# EAGLE design MiniPS-1c (EAGLE 5.06)
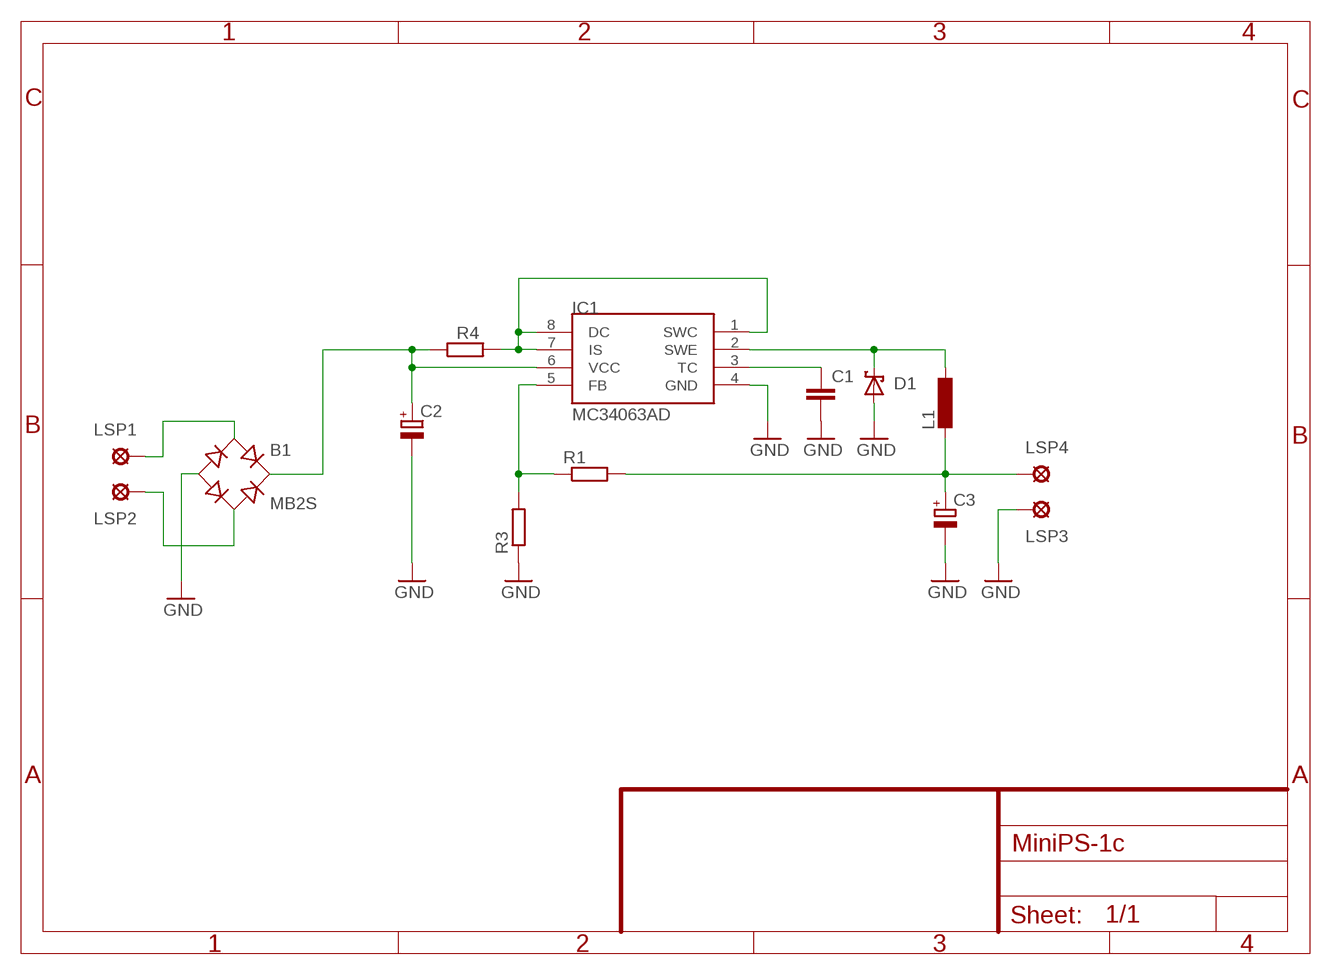
[diagram p0: schematic, sheet 1]

## Parts
B1  MB2S  [SOIC-4]
C1  C-EUC0805  [C0805]
C2  CPOL-EUG  [PANASONIC_G]
C3  CPOL-EUF  [PANASONIC_F]
D1  SCHOTTKY-DIODESMD  [SMB]
IC1  MC34063AD  [SOIC8]
L1  DO3316P  [DO3316P]
LSP1  SE14  [SE14]
LSP2  SE14  [SE14]
LSP3  SE14  [SE14]
LSP4  SE14  [SE14]
R1  R-EU_R1206  [R1206]
R3  R-EU_R1206  [R1206]
R4  R-EU_R1206  [R1206]

## Nets
GND: B1.- C1.2 C2.- C3.- D1.A IC1.4(GND) LSP3.MP R3.1
N$1: C3.+ L1.1 LSP4.MP R1.2
N$2: B1.+ C2.+ IC1.6(VCC) R4.1
N$3: B1.~2(AC2) LSP2.MP
N$4: B1.~1(AC1) LSP1.MP
N$7: IC1.5(FB) R1.1 R3.2
N$8: C1.1 IC1.3(TC)
N$9: D1.C IC1.2(SWE) L1.2
N$10: IC1.1(SWC) IC1.7(IS) IC1.8(DC) R4.2

## Library data of the parts
B1 = rectifier:MB*S: Bridge Rectifier Source: http://www.fairchildsemi.com/ds/MB/MB6S.pdf
C1 = rcl:C-EU: CAPACITOR, European symbol
C2 C3 = rcl:CPOL-EU: POLARIZED CAPACITOR, European symbol
D1 = diode:SCHOTTKY-DIODE: Schottky Diode
IC1 = mc34063:MC34063
L1 = inductor-coilcraft:DO3316P: COILCRAFT
LSP1-LSP4 = solpad:SE14: SOLDER PAD E1553, drill 1,4mm, distributor Buerklin, 07F820
R1 R3 R4 = rcl:R-EU_: RESISTOR, European symbol

## Board
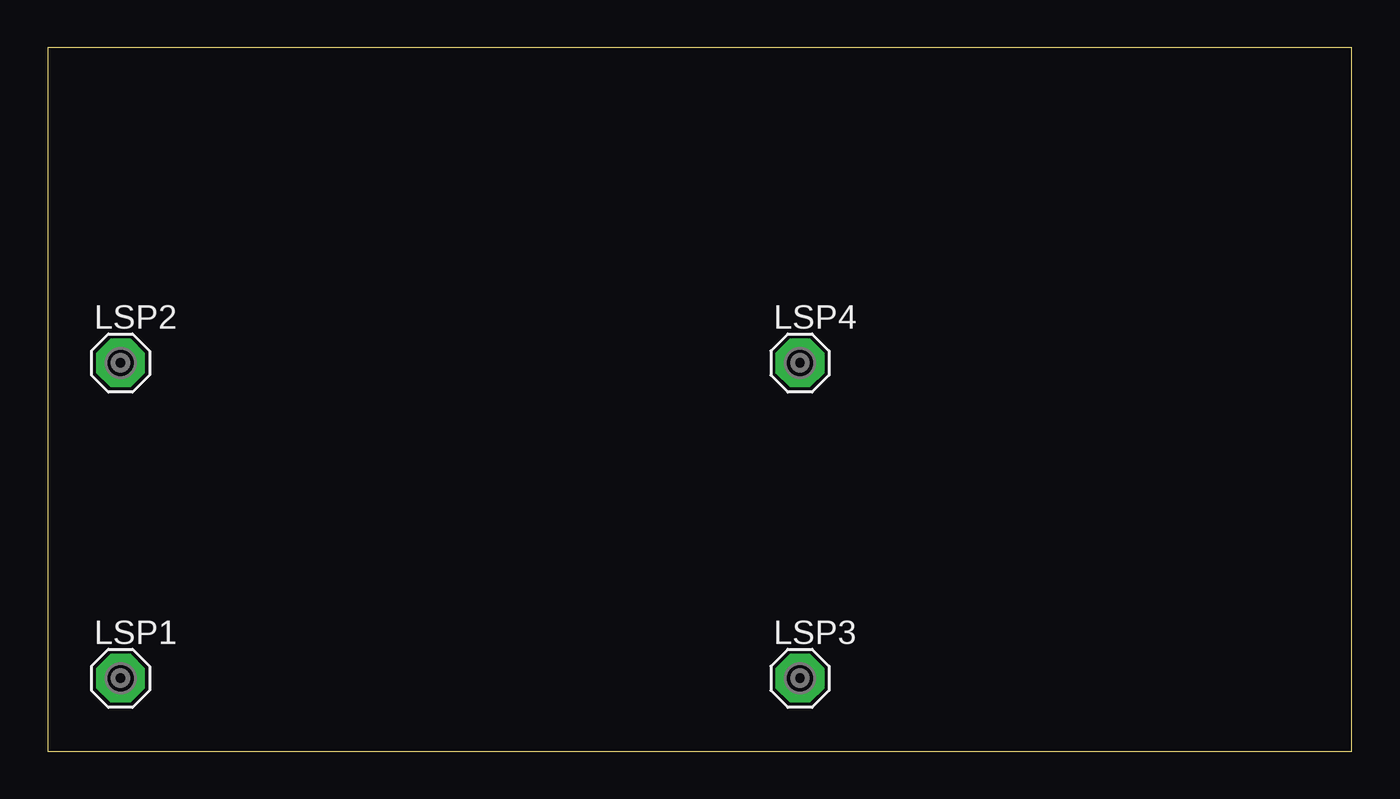
[diagram p1: board, top side]
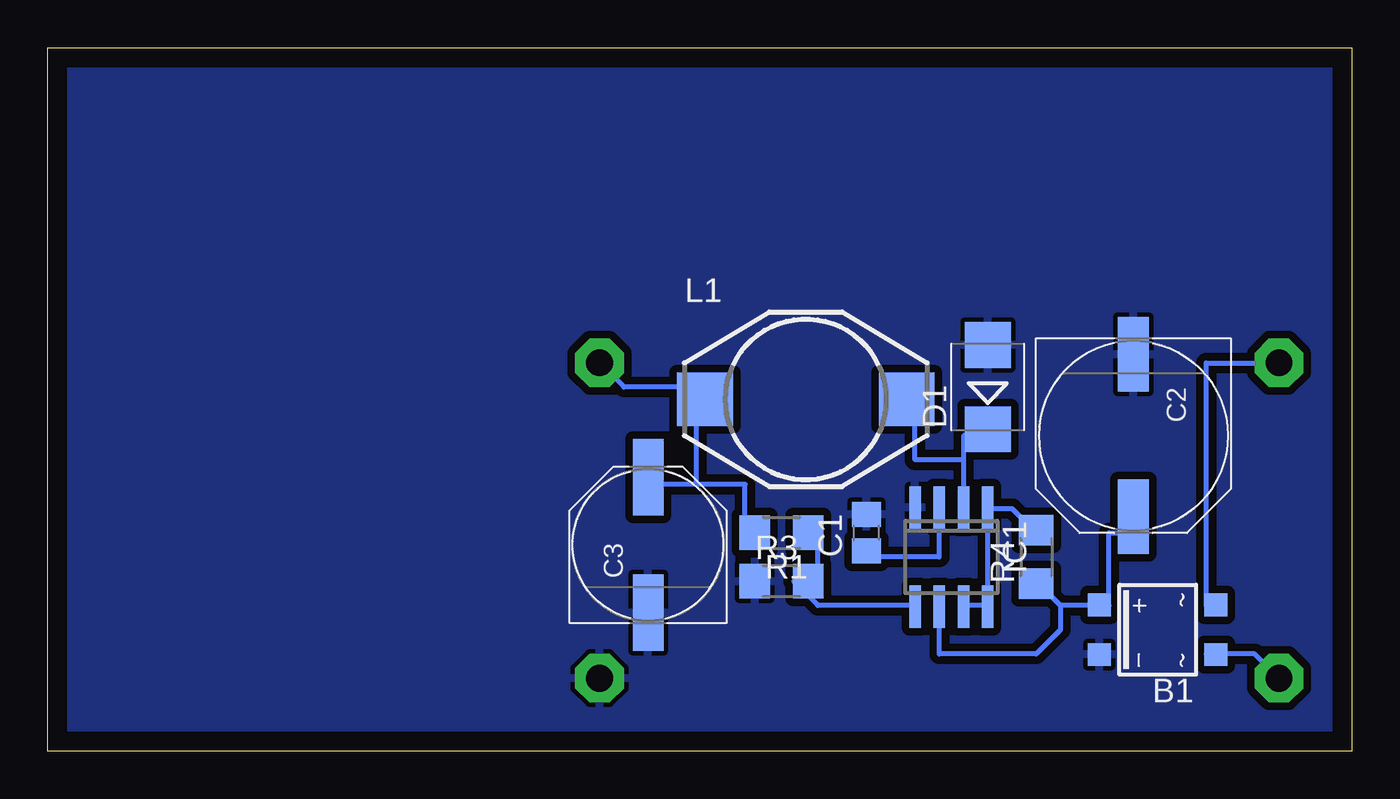
[diagram p2: board, bottom side, seen from below]

Size 68.25 x 36.82 mm. Coordinates in mm from the lower left corner, seen from the top.
Outline: 0,0 68.25,0 68.25,36.82 0,36.82 0,0
Copper layers (1*16): Top 0.035mm / dielectric 1.5mm / Bottom 0.035mm
Design rules "default": minimum track width 10mil, minimum drill 24mil, track to track 8mil, track to pad 8mil, pad to pad 8mil, via to via 8mil, smd to smd 8mil, copper to edge 40mil, drill to drill 8mil, minimum pad ring 10mil, minimum via ring 8mil, stop-mask expansion 4mil, vias tented up to drill 0mil, thermal gap 10mil

### Footprints (pad centres in the part's own frame; a part is rotated, then mirrored left to right if it is on the bottom)
SOIC-4 = smd 1.2 x 1.2: + 1.3,3.05; - -1.3,3.05; ~1 -1.3,-3.05; ~2 1.3,-3.05
C0805 = smd 1.3 x 1.5: 1 -0.95,0; 2 0.95,0
PANASONIC_G = smd 3.9 x 1.6: + 4.25,0; - -4.25,0
PANASONIC_F = smd 4 x 1.6: + 3.55,0; - -3.55,0
SMB = smd 2.4 x 2.4: A 2.2,0; C -2.2,0
SOIC8 = smd 0.6 x 2.2: 1 -1.905,-2.6; 2 -0.635,-2.6; 3 0.635,-2.6; 4 1.905,-2.6; 5 1.905,2.6; 6 0.635,2.6; 7 -0.635,2.6; 8 -1.905,2.6
DO3316P = smd 2.92 x 2.79: 1 -5.28,0; 2 5.28,0
SE14 = drill 1.397 pad 2.54 octagon: MP 0,0
R1206 = smd 1.6 x 1.8: 1 -1.4,0; 2 1.4,0

### Placement (x,y rotation side)
B1  10.16,6.35 90 bottom
C1  25.4,11.43 90 bottom
C2  11.43,16.51 270 bottom
C3  36.83,10.79 90 bottom
D1  19.05,19.05 90 bottom
IC1  20.95,10.16 180 bottom
L1  28.57,18.41 0 bottom
LSP1  3.81,3.81 0 top
LSP2  3.81,20.32 0 top
LSP3  39.37,3.81 0 top
LSP4  39.37,20.32 0 top
R1  29.84,11.43 180 bottom
R3  29.84,8.89 0 bottom
R4  16.51,10.16 90 bottom

### Tracks (layer width: path | path; a pad name or v marks a point on that pad's centre or on a via)
GND
  pour Bottom (isolate 0.406): 0,38.1 69.85,38.1 69.85,-1.27 -1.27,-1.27 -1.27,38.1
N$1
  Bottom 0.254: 34.29,13.97 36.83,13.97 C3.+ | 34.29,13.97 31.75,13.97 31.75,11.43 R1.2 | 34.29,13.97 34.29,17.78 L1.1 34.29,19.05 38.1,19.05 LSP4.MP
N$2
  Bottom 0.254: 12.7,7.62 12.7,11.43 11.43,11.43 C2.+ | 15.24,7.62 16.51,8.89 R4.1 | 12.7,7.62 15.24,7.62 | B1.+ 12.7,7.62 | 15.24,7.62 15.24,6.35 16.51,5.08 21.59,5.08 IC1.6 21.59,7.62
N$3
  Bottom 0.254: LSP2.MP 7.62,20.32 7.62,7.62 B1.~2
N$4
  Bottom 0.254: LSP1.MP 5.08,5.08 7.62,5.08 B1.~1
N$7
  Bottom 0.254: R1.1 27.94,11.43 27.94,8.89 R3.2 29.21,8.89 27.94,7.62 22.86,7.62 IC1.5
N$8
  Bottom 0.254: C1.1 25.4,10.16 21.59,10.16 IC1.3
N$9
  Bottom 0.254: 20.32,15.24 20.32,16.51 19.05,16.51 D1.C | 20.32,15.24 IC1.2 20.32,12.7 | 20.32,15.24 22.86,15.24 22.86,17.78 L1.2
N$10
  Bottom 0.254: 19.05,7.62 20.32,7.62 IC1.7 | 19.05,12.7 17.78,12.7 16.51,11.43 R4.2 | 19.05,7.62 19.05,12.7 | IC1.8 19.05,7.62 | 19.05,12.7 IC1.1